# Altium schematic sheet XC95144XL.SchDoc
size Letter
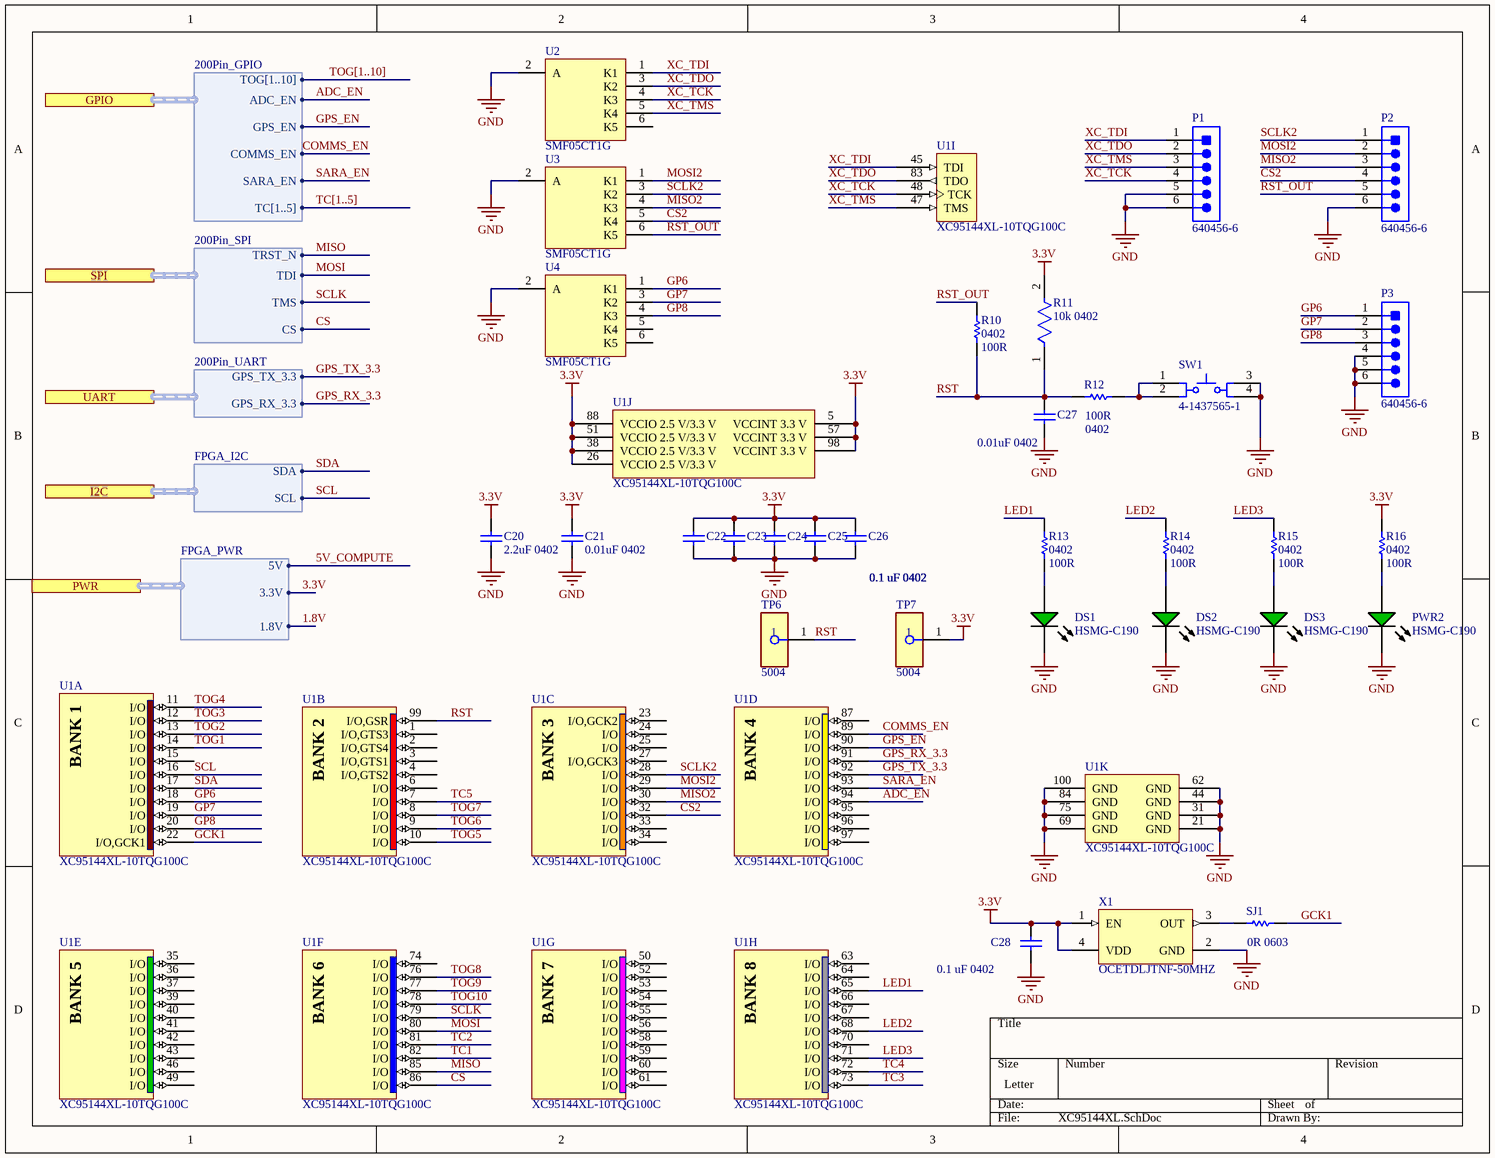
[diagram p0: XC95144XL.SchDoc]

## Parts
C20  2.2uF 0402  [CAPC0402(1005)60_M]
C21  0.01uF 0402  [CAPC1005X55X30NL05T10]
C22  0.1 uF 0402  [CAPC1005X55X30ML05T10]
C23  0.1 uF 0402  [CAPC1005X55X30ML05T10]
C24  0.1 uF 0402  [CAPC1005X55X30ML05T10]
C25  0.1 uF 0402  [CAPC1005X55X30ML05T10]
C26  0.1 uF 0402  [CAPC1005X55X30ML05T10]
C27  0.01uF 0402  [CAPC1005X55X30NL05T10]
C28  0.1 uF 0402  [CAPC1005X55X30ML05T10]
DS1  HSMG-C190  [AVAG-HSMX-C190_V]
DS2  HSMG-C190  [AVAG-HSMX-C190_V]
DS3  HSMG-C190  [AVAG-HSMX-C190_V]
P1  640456-6  [TECO-640456-6_V]
P2  640456-6  [TECO-640456-6_V]
P3  640456-6  [TECO-640456-6_V]
PWR2  HSMG-C190  [AVAG-HSMX-C190_V]
R10  0402  spec: 100R  [RESC1005X40X25ML05T10]
R11  10k 0402  [FP-CRCW0402-e3-IPC_B]
R12  0402  spec: 100R  [RESC1005X40X25ML05T10]
R13  0402  spec: 100R  [RESC1005X40X25ML05T10]
R14  0402  spec: 100R  [RESC1005X40X25ML05T10]
R15  0402  spec: 100R  [RESC1005X40X25ML05T10]
R16  0402  spec: 100R  [RESC1005X40X25ML05T10]
SJ1  0R 0603  [RESC1609X55X30ML10T20]
SW1  4-1437565-1  [TECO-4-1437565-1_V]
TP6  5004  [FP-5004-MFG]
TP7  5004  [FP-5004-MFG]
U1  XC95144XL-10TQG100C  [TQG100_L]  (parts A,B,C,D,E,F,G,H,I,J,K of 11)
U2  SMF05CT1G  [ONSC-SC70-6-419B-02_W_V]
U3  SMF05CT1G  [ONSC-SC70-6-419B-02_W_V]
U4  SMF05CT1G  [ONSC-SC70-6-419B-02_W_V]
X1  OCETDLJTNF-50MHZ  [TXC-L500W700H130-4_V]

## Ports
GPIO (harness 200Pin_GPIO), I2C (harness FPGA_I2C), PWR (harness FPGA_PWR), SPI (harness 200Pin_SPI), UART (harness 200Pin_UART)

## Harnesses
FPGA_PWR: 5V, 3.3V, 1.8V
FPGA_I2C: SDA, SCL
200Pin_UART: GPS_TX_3.3, GPS_RX_3.3
200Pin_SPI: TRST_N, TDI, TMS, CS
200Pin_GPIO: TOG[1..10], ADC_EN, GPS_EN, COMMS_EN, SARA_EN, TC[1..5]

## Nets
3.3V: C20.2 C21.2 C22.2 C23.2 C24.2 C25.2 C26.2 C28.2 R11.2 R16.2 TP7.1 U1.5(VCCINT_3.3_V) U1.26(VCCIO_2.5_V/3.3_V) U1.38(VCCIO_2.5_V/3.3_V) U1.51(VCCIO_2.5_V/3.3_V) U1.57(VCCINT_3.3_V) U1.88(VCCIO_2.5_V/3.3_V) U1.98(VCCINT_3.3_V) X1.1(EN) X1.4(VDD) ; port PWR.3.3V
GND: C20.1 C21.1 C22.1 C23.1 C24.1 C25.1 C26.1 C27.1 C28.1 DS1.2(K) DS2.2(K) DS3.2(K) P1.5 P1.6 P2.6 P3.4 P3.5 P3.6 PWR2.2(K) SW1.3 SW1.4 U1.21(GND) U1.31(GND) U1.44(GND) U1.62(GND) U1.69(GND) U1.75(GND) U1.84(GND) U1.100(GND) U2.2(A) U3.2(A) U4.2(A) X1.2(GND)
1.8V: port PWR.1.8V
5V_COMPUTE: port PWR.5V
ADC_EN: U1.94(I/O) ; port GPIO.ADC_EN
COMMS_EN: U1.89(I/O) ; port GPIO.COMMS_EN
CS: U1.86(I/O) ; port SPI.CS
CS2: P2.4 U1.32(I/O) U3.5(K4)
GCK1: SJ1.2 U1.22(I/O,GCK1)
GP6: P3.1 U1.18(I/O) U4.1(K1)
GP7: P3.2 U1.19(I/O) U4.3(K2)
GP8: P3.3 U1.20(I/O) U4.4(K3)
GPS_EN: U1.90(I/O) ; port GPIO.GPS_EN
GPS_RX_3.3: U1.91(I/O) ; port UART.GPS_RX_3.3
GPS_TX_3.3: U1.92(I/O) ; port UART.GPS_TX_3.3
LED1: R13.2 U1.65(I/O)
LED2: R14.2 U1.68(I/O)
LED3: R15.2 U1.71(I/O)
MISO: U1.85(I/O) ; port SPI.TRST_N
MISO2: P2.3 U1.30(I/O) U3.4(K3)
MOSI: U1.80(I/O) ; port SPI.TDI
MOSI2: P2.2 U1.29(I/O) U3.1(K1)
RST: C27.2 R10.2 R11.1 R12.2 TP6.1 U1.99(I/O,GSR)
RST_OUT: P2.5 R10.1 U3.6(K5)
SARA_EN: U1.93(I/O) ; port GPIO.SARA_EN
SCL: U1.16(I/O) ; port I2C.SCL
SCLK: U1.79(I/O) ; port SPI.TMS
SCLK2: P2.1 U1.28(I/O) U3.3(K2)
SDA: U1.17(I/O) ; port I2C.SDA
TC1: U1.82(I/O)
TC2: U1.81(I/O)
TC3: U1.73(I/O)
TC4: U1.72(I/O)
TC5: U1.7(I/O)
TOG1: U1.14(I/O)
TOG2: U1.13(I/O)
TOG3: U1.12(I/O)
TOG4: U1.11(I/O)
TOG5: U1.10(I/O)
TOG6: U1.9(I/O)
TOG7: U1.8(I/O)
TOG8: U1.76(I/O)
TOG9: U1.77(I/O)
TOG10: U1.78(I/O)
XC_TCK: P1.4 U1.48(TCK) U2.4(K3)
XC_TDI: P1.1 U1.45(TDI) U2.1(K1)
XC_TDO: P1.2 U1.83(TDO) U2.3(K2)
XC_TMS: P1.3 U1.47(TMS) U2.5(K4)
NetDS1_1: DS1.1(A) R13.1
NetDS2_1: DS2.1(A) R14.1
NetDS3_1: DS3.1(A) R15.1
NetPWR2_1: PWR2.1(A) R16.1
NetR12_1: R12.1 SW1.1 SW1.2
NetSJ1_1: SJ1.1 X1.3(OUT)

Not connected (* = marked no-connect by the designer): U1 1(I/O,GTS3) 2(I/O,GTS4) 3(I/O,GTS1) 4(I/O,GTS2) 6(I/O) 15(I/O) 23(I/O,GCK2) 24(I/O) 25(I/O) 27(I/O,GCK3) 33(I/O) 34(I/O) 35(I/O) 36(I/O) 37(I/O) 39(I/O) 40(I/O) 41(I/O) 42(I/O) 43(I/O) 46(I/O) 49(I/O) 50(I/O) 52(I/O) 53(I/O) 54(I/O) 55(I/O) 56(I/O) 58(I/O) 59(I/O) 60(I/O) 61(I/O) 63(I/O) 64(I/O) 66(I/O) 67(I/O) 70(I/O) 74(I/O) 87(I/O) 95(I/O) 96(I/O) 97(I/O); U2 6(K5); U4 5(K4) 6(K5)

## Buses and harness runs
bus TC[1..5]
bus TOG[1..10]

## Notes on the sheet
- (in symbol CMP-0209-00147-1, part A) BANK 1
- (in symbol CMP-0209-00147-1, part B) BANK 2
- (in symbol CMP-0209-00147-1, part C) BANK 3
- (in symbol CMP-0209-00147-1, part D) BANK 4
- (in symbol CMP-0209-00147-1, part E) BANK 5
- (in symbol CMP-0209-00147-1, part F) BANK 6
- (in symbol CMP-0209-00147-1, part G) BANK 7
- (in symbol CMP-0209-00147-1, part H) BANK 8

## Library data of the parts
C20 = CMP-1034-02125-1: CAP 2.2uF 6.3V ±10% 0402 (1005 Metric) Thickness 0.6mm SMD; Case-Metric: 1005; Case-EIA: 0402; Tolerance: Â±10%; Value: 2.2uF; Technology: SMT; Rated Voltage: 6.3 V; Max Thickness: 0.6 mm
C21 C27 = CMP-2008-03072-1: Manufacturer: Kemet; Part Number: C0402C103K4RACTU
C22-C26 C28 = CMP-2008-03080-1: Manufacturer: Kemet; Part Number: C0402C104J4RACTU
DS1-DS3 PWR2 = CMP-1744-00002-1: Chip LED, Green, 2.2 V, -40 to 85 degC, 2-Pin SMD, RoHS, Tape and Reel; Frequency: 400 KHz; Max Supply Voltage: 5.5 V; Access Time: 3500 ns; Clock Frequency: 100 KHz; Case\Package: SOIC; Density: 32 kb; Nominal Supply Current: 2 mA; Interface: Serial; Min Supply Voltage: 1.7 V; Packaging: Tape and Reel; PackageReference: HSMX-C190; ComponentLink2URL: http://docs.avagotech.com/docs/AV02-0551EN; RoHSCompliant: true; Pins: 8; REACH SVHC: No SVHC; Max Operating Temperature: 85 degC; Width: 4 mm; Radiation Hardening: No; Package Quantity: 3000; ComponentLink3Description: Package Specification; ComponentLink1Description: Manufacturer URL; Min Operating Temperature: -40 degC; PackageDescription: 2-Pin Surface Mount Device, Body 1.6 x 0.8 mm, Height 0.9 mm; Max Clock Frequency: 100 KHz; Height: 1.5 mm; ComponentLink1URL: http://www.avagotech.com/; DatasheetVersion: Mar-12; ComponentLink2Description: Datasheet; Mount: Surface Mount; Length: 5 mm; ComponentLink3URL: http://www.fairchildsemi.com/dwg/MA/MA03D.pdf
P1-P3 = CMP-2000-05661-1: Male Header, Pitch 2.54 mm, 1 x 6 Position, Height 10.03 mm, Tail Length 3.56 mm, -55 to 105 degC, Bulk; Manufacturer: TE Connectivity; Contact Centerline Spacing: 0.100 / in.; Number of Contacts: 6; Current, Rating: 5 / A; Agency Approvals: CSA,UL; Material, Contact: CopperAlloy; Mounting Hole Size: 0.04 / "; Brand/Series: MTA-100Series; Pin Spacing: 0.1 / "; Mount Angle: Vertical; Contact Termination Area Plating: Tin; Angle: Straight; Primary Type: InterconnectSystem; Standards: RoHSCompliant,ELVCompliant,UL94V-0; Temperature, Operating: -55to+105 / °C; Material, Housing: Polyester; Special Features: Pinstrip; Color, Housing: White; Connector Type: MTA-100; Voltage, Rating: 250 / V; Termination: Solder; Package Reference: 640456-6; Size, Post: 0.025 / in.; Color: White; Datasheet URL: https://datasheet.ciiva.com/25618/0900766b80eb7fdd-25618163.pdf; Manufacturer URL: http://www.te.com/; Mounting Type: PCMount; Length, Pin: 0.14 / "; Type: PCBPlug; Length, Overall: 0.6 / "; Mounting Technology: ThroughHole; Number of Rows: 1; Contact Shape: Square; Contact Mating Area Plating: Tin; Datasheet Version: Rev. W, 05/2005; Number of Positions: 6; Package Description: Male Header, Pitch 2.54 mm, 1 x 6 Position, Height 10.03 mm, Tail Length 3.56 mm; Contact Plating: Tin; Length, Terminal Post: 0.14 / in.; Flammability Rating: UL94V-0
R10 R12-R16 = CMP-2002-07344-1: Part Number: RC0402FR-07100RL; Manufacturer: Yageo / Phycomp
R11 = CMP-02407-001195-1: RES SMD 10K OHM 1% 1/16W 0402; Power Rating: 63mW; Resistance: 10kR; Voltage Rating: 50V; Temperature Coefficient: 100ppm/°C; Case Code (Metric): 1005; Features: Automotive AEC-Q200; Termination: SMD/SMT; Mount: Surface Mount; Package Quantity: 10; Packaging: Tape and Reel; Case Code (Imperial): 0402; Weight: 2.3E-05oz; Lead Free: Lead Free; Width: 0.02inch; Max Power Dissipation: 63mW; Tolerance: 1%; Number of Terminations: 2; Height: 0.35mm; Number of Pins: 2; Composition: Thick Film; Length: 1mm; Voltage Rating (DC): 50V; Case/Package: 0402; Radiation Hardening: No; Contact Plating: Tin; Depth: 0.5mm; Military Standard: Not; Min Operating Temperature: -55°C; Max Operating Temperature: 155°C
SJ1 = CMP-2000-03816-1: Part Number: CRCW06030000Z0EA; Manufacturer: Vishay Dale
SW1 = CMP-2000-05602-1: Tactile Switch, 50 mA, 12 VDC, -20 to 85 degC, 4-Pin SMD, RoHS, Bulk; Manufacturer: TEConnectivity/AMPBrand; Illumination Type: N/R; Maximum Contact Resistance: 100mOhm; Actuator Style: RoundButton; Actuator Length: 1.4mm; Contact Rating @ Voltage: 0.05@12VDCA; Maximum DC Voltage Rating: 12V; Body Orientation: Straight; Ground Terminal: No; Dielectric Strength: 500VAC; Operating Force: 1.57N; Electrical Life: 100000Cycle; Mechanical Life: N/A; Family: FSMJSMA; Contact Material: CopperAlloy; Type: N/A; RoHS: Yes; Pole Throw Configuration: N/A; Operating Temperature: -20to85C; Minimum Insulation Resistance: 100MOhm; Package Description: 4-Pin Surface Mount Device, Body 6 x 6 mm, Pitch 9.1 mm; Housing Material: N/A; Switch Configuration: N/A; Mounting: SurfaceMount,GullWing; Datasheet URL: https://datasheet.ciiva.com/14635/0900766b80912216-14635826.pdf; Packaging: Bulk; Base Material: N/A; Actuator Color: N/A; Dimension: 6x10x5.25mm; Contact Plating: Silver; Seal Location: N/A; Mounting Technology: SurfaceMount; Part No: 4-1437565-1; Seal Description: N/A; Maximum AC Voltage Rating: N/A; Datasheet Version: 04/2007; Manufacturer URL: http://www.te.com/; Package Reference: 4-1437565-1; Product Weight: N/A
TP6 TP7 = CMP-2000-05575-2: PC TEST POINT MINIATURE YELLOW; Manufacturer: Keystone; Number Of Contacts: 1; Is Female: yes; Device Class L1: Connectors; Manufacturer Part Number: 5004; Digikey Description: PC TEST POINT MINIATURE YELLOW; ComponentLink2URL: https://www.keyelco.com/product-pdf.cfm?p=1313; Lead Free: Yes; ComponentLink2Description: Datasheet; Category: Conn; Height: 4.72mm; Octopart: https://octopart.com/5004-keystone-28591; Mouser Description: TEST POINT PC MINI .040"D YELLOW; Device Class L3: unset; Contact Material: Silver; Package: 5004; Automotive: No; Device Class L2: unset; RoHS: TRUE
U1 = CMP-0209-00147-1: FastFLASH XC900XL, 3.3V High-Performance 144 Macrocell CPLD, 81 User I/Os, 100-Pin TQFP, Speed Grade 10, Commercial Grade, Pb-Free; PackageDescription: 100-Pin Thin Quad Flat Pack (TQG100) - Pb-Free; PackageVersion: ver1.2, Jun-2004; DatasheetVersion: ver2.0, Apr-2007; PackageReference: TQG100
U2-U4 = CMP-1061-00155-1: 5-Line Transient Voltage Suppressor Array, 6-Pin SC70, Pb-Free, Tape and Reel; Manufacturer: On Semiconductor; PPK Max (W): 100; Direction: Unidirectional; IR Max (uA): 5; PackageDescription: 6-Pin Small Outline Transistor, Body 2 x 1.25 mm, Pitch 0.65 mm; PackageReference: SC70-6-419B-02_W; ComponentLink2Description: Datasheet; Mounting Technology: Surface Mount; Packing: Tape and Reel; DatasheetVersion: Rev. 4; ComponentLink1Description: Manufacturer URL; ComponentLink2URL: http://www.onsemi.com/pub_link/Collateral/SMF05C-D.PDF; ComponentLink3Description: Package Specification; ComponentLink1URL: http://www.onsemi.com/; ComponentLink3URL: http://www.onsemi.com/pub_link/Collateral/SMF05C-D.PDF; PackageVersion: Rev. W; PartNumber: SMF05CT1G; RoHS: Pb-Free
X1 = CMP-0269-00001-1: OSC, 50.000 MHZ, ± 25 ppm, 3.3 V, SMT / OCETDLJTNF-50MHZ; PartNumber: 7W-50.000MBA-T; Rise/Fall Time: 7 ns; Body Shape: Rectangular, 4 SMD; Frequency Stability: Â± 25 ppm(-10 to +70 degC); ComponentLink2Description: Datasheet; Mounting Technology: Surface Mount; Storage Temperature: -50 to 125 degC; PackageReference: L500W700H130-4; ComponentLink1URL: http://www.txccrystal.com/; ComponentLink2URL: http://www.txccrystal.com/images/pdf/7w-tight.pdf; ComponentLink1Description: Manufacturer URL; PackageDescription: 4-Pin SMT LED, 7 x 5 mm Body; Operating Temperature Range: -40 to 85 degC